# Altium schematic sheet STM32_ESP.SchDoc
size 330 x 203 mm
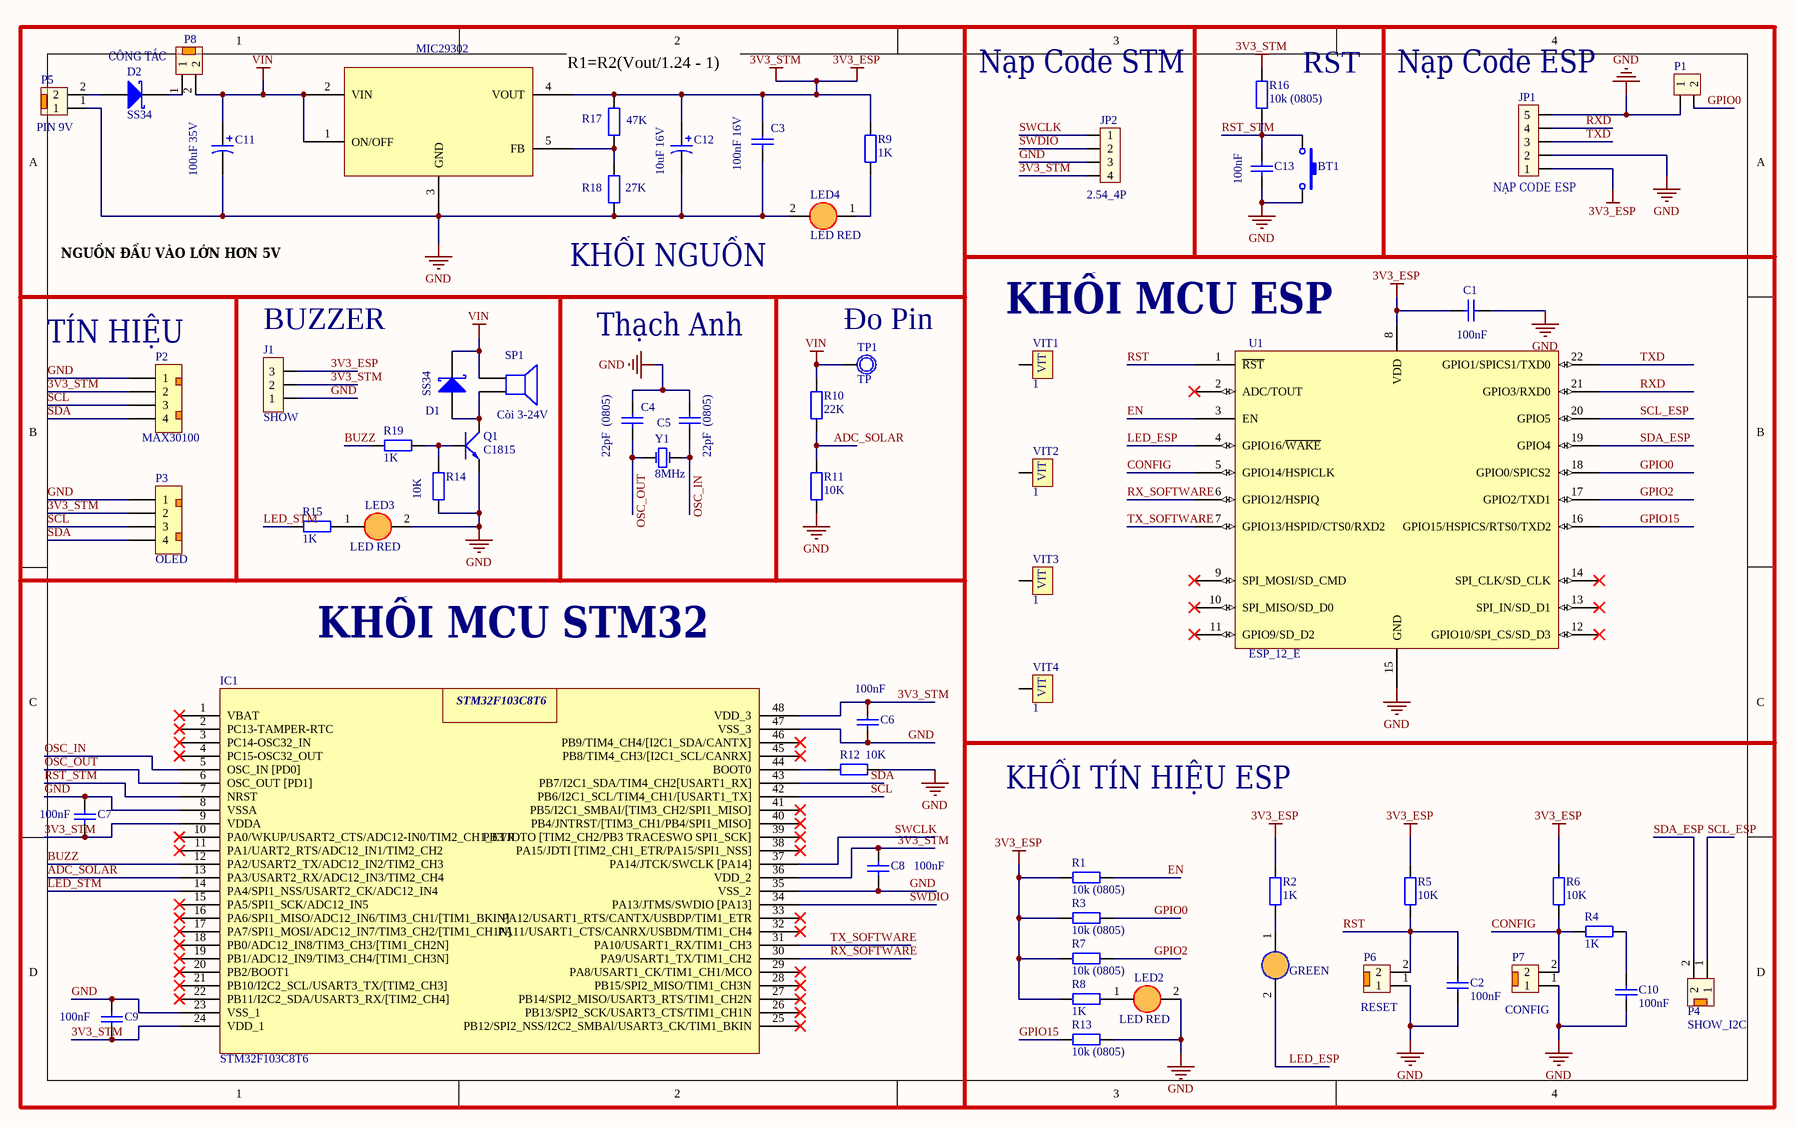
[diagram p0: STM32_ESP.SchDoc]

## Parts
BT1  Nút Nhấn 2 Chân 3x6x2.5MM SMD  [Nut Nhan 2 Chan SMD_N]  (value not drawn)
C1  100nF  [Tu 0805]
C2  100nF  [tu 0805]
C3  100nF 16V  [tu 0805]
C4  22pF  (0805)  [tu 0805]
C5  22pF  (0805)  [tu 0805]
C6  100nF  [tu 0805]
C7  100nF  [tu 0805]
C8  100nF  [tu 0805]
C9  100nF  [tu 0805]
C10  100nF  [tu 0805]
C11  100uF 35V  [CAP_ALUM_SMD_100102_TYPE_G]
C12  10uF 16V  [CAP_ALUM_SMD_5054_TYPE_C]
C13  100nF  [tu 0805]
D1  SS34  [DIODE_DO214AC_SMA]
D2  SS34  [DIODE_DO214AC_SMA]
IC1  STM32F103C8T6  [LQFP48]
J1  SHOW  [jump don duc thang 2.54_3p]
JP1  NẠP CODE ESP  [jump don duc 2.54_5p]
JP2  2.54_4P  [JUMP DON DUC 2.54_4P]
LED1  GREEN  [led 0805]
LED2  LED RED  [led 0805]
LED3  LED RED  [led 0805]
LED4  LED RED  [led 0805]
MIC1  MIC29302  [Mic5V]
P1  2P  [Jump don duc 2.54_2P]  (value not drawn)
P2  MAX30100  [Header Duc Thang 4p 2.54]
P3  OLED  [Header Duc Thang 4p 2.54]
P4  SHOW_I2C  [Header Duc Thang 2P 2.54]
P5  PIN 9V  [Header Duc Thang 2P 2.54]
P6  RESET  [Header Duc Thang 2P 2.54]
P7  CONFIG  [Header Duc Thang 2P 2.54]
P8  CÔNG TẮC  [Header Duc Thang 2P 2.54]
Q1  C1815  [SOT23B]
R1  10k (0805)  [tro 0805]
R2  1K  [tro 0805]
R3  10k (0805)  [tro 0805]
R4  1K  [tro 0805]
R5  10K  [tro 0805]
R6  10K  [tro 0805]
R7  10k (0805)  [tro 0805]
R8  1K  [tro 0805]
R9  1K  [tro 0805]
R10  22K  [tro 0805]
R11  10K  [tro 0805]
R12  10K  [tro 0805]
R13  10k (0805)  [tro 0805]
R14  10K  [tro 0805]
R15  1K  [tro 0805]
R16  10k (0805)  [tro 0805]
R17  47K  [tro 0805]
R18  27K  [tro 0805]
R19  1K  [tro 0805]
SP1  Còi 3-24V  [SPEAKER]
TP1  TP  [TP1]
U1  ESP_12_E  [ESP8266_12_E_L]
VIT1  1  [VIT]
VIT2  1  [VIT]
VIT3  1  [VIT]
VIT4  1  [VIT]
Y1  8MHz  [thach anh 49s smd]

## Nets
3V3_ESP: C1.2 C3.1 C6.1 C7.2 C8.1 C9.2 C12.1 IC1.9(VDDA) IC1.24(VDD_1) IC1.36(VDD_2) IC1.48(VDD_3) J1.2 J1.3 JP1.1 JP2.4 MIC1.4(VOUT) P2.2 P3.2 R1.2 R2.1 R3.2 R5.1 R6.1 R7.2 R8.1 R9.2 R16.2 R17.1 U1.8(VDD)  [also labelled 3V3_STM]
GND: BT1.2 C1.1 C2.2 C3.2 C4.1 C5.1 C6.2 C7.1 C8.2 C9.1 C10.2 C11.2 C12.2 C13.2 IC1.8(VSSA) IC1.23(VSS_1) IC1.35(VSS_2) IC1.47(VSS_3) J1.1 JP1.2 JP1.5 JP2.3 LED2.2(K) LED3.2(K) LED4.2(K) MIC1.3(GND) P1.1 P2.1 P3.1 P5.1 P6.1 P7.1 Q1.1(E) R11.1 R12.2 R13.1 R14.1 R18.2 U1.15(GND)
VIN: C11.1 D1.2(K) MIC1.1(ON/OFF) MIC1.2(VIN) P8.2 R10.2 SP1.1 TP1.1
ADC_SOLAR: IC1.13(PA3/USART2_RX/ADC12_IN3/TIM2_CH4) R10.1 R11.2
BUZZ: IC1.12(PA2/USART2_TX/ADC12_IN2/TIM2_CH3) R19.2
CONFIG: P7.2 R4.1 R6.2 U1.5(GPIO14/HSPICLK)
EN: R1.1 U1.3(EN)
GPIO0: P1.2 R3.1 U1.18(GPIO0/SPICS2)
GPIO2: R7.1 U1.17(GPIO2/TXD1)
GPIO15: R13.2 U1.16(GPIO15/HSPICS/RTS0/TXD2)
LED_ESP: LED1.2(K) U1.4(GPIO16/~{WAKE})
LED_STM: IC1.14(PA4/SPI1_NSS/USART2_CK/ADC12_IN4) R15.1
OSC_IN: C5.2 IC1.5(OSC_IN_[PD0]) Y1.2(OSC2)
OSC_OUT: C4.2 IC1.6(OSC_OUT_[PD1]) Y1.1(OSC1)
RST: C2.1 P6.2 R5.2 U1.1(~{RST})
RST_STM: BT1.1 C13.1 IC1.7(NRST) R16.1
RX_SOFTWARE: IC1.30(PA9/USART1_TX/TIM1_CH2) U1.6(GPIO12/HSPIQ)
RXD: JP1.4 U1.21(GPIO3/RXD0)
SCL: IC1.42(PB6/I2C1_SCL/TIM4_CH1/[USART1_TX]) P2.3 P3.3
SCL_ESP: P4.1 U1.20(GPIO5)
SDA: IC1.43(PB7/I2C1_SDA/TIM4_CH2[USART1_RX]) P2.4 P3.4
SDA_ESP: P4.2 U1.19(GPIO4)
SWCLK: IC1.37(PA14/JTCK/SWCLK_[PA14]) JP2.1
SWDIO: IC1.34(PA13/JTMS/SWDIO_[PA13]) JP2.2
TX_SOFTWARE: IC1.31(PA10/USART1_RX/TIM1_CH3) U1.7(GPIO13/HSPID/CTS0/RXD2)
TXD: JP1.3 U1.22(GPIO1/SPICS1/TXD0)
NetC10_1: C10.1 R4.2
NetD1_1: D1.1(A) Q1.2(C) SP1.2
NetD2_1: D2.1(A) P5.2
NetD2_2: D2.2(K) P8.1
NetIC1_44: IC1.44(BOOT0) R12.1
NetLED1_1: LED1.1(A) R2.2
NetLED2_1: LED2.1(A) R8.2
NetLED3_1: LED3.1(A) R15.2
NetLED4_1: LED4.1(A) R9.1
NetMIC1_5: MIC1.5(FB) R17.2 R18.1
NetQ1_3: Q1.3(B) R14.2 R19.1

Not connected (* = marked no-connect by the designer): IC1 1(VBAT)* 2(PC13-TAMPER-RTC)* 3(PC14-OSC32_IN)* 4(PC15-OSC32_OUT)* 10(PA0/WKUP/USART2_CTS/ADC12-IN0/TIM2_CH1_ETR)* 11(PA1/UART2_RTS/ADC12_IN1/TIM2_CH2)* 15(PA5/SPI1_SCK/ADC12_IN5)* 16(PA6/SPI1_MISO/ADC12_IN6/TIM3_CH1/[TIM1_BKIN])* 17(PA7/SPI1_MOSI/ADC12_IN7/TIM3_CH2/[TIM1_CH1N])* 18(PB0/ADC12_IN8/TIM3_CH3/[TIM1_CH2N])* 19(PB1/ADC12_IN9/TIM3_CH4/[TIM1_CH3N])* 20(PB2/BOOT1)* 21(PB10/I2C2_SCL/USART3_TX/[TIM2_CH3])* 22(PB11/I2C2_SDA/USART3_RX/[TIM2_CH4])* 25(PB12/SPI2_NSS/I2C2_SMBAl/USART3_CK/TIM1_BKIN)* 26(PB13/SPI2_SCK/USART3_CTS/TIM1_CH1N)* 27(PB14/SPI2_MISO/USART3_RTS/TIM1_CH2N)* 28(PB15/SPI2_MISO/TIM1_CH3N)* 29(PA8/USART1_CK/TIM1_CH1/MCO)* 32(PA11/USART1_CTS/CANRX/USBDM/TIM1_CH4)* 33(PA12/USART1_RTS/CANTX/USBDP/TIM1_ETR)* 38(PA15/JDTI_[TIM2_CH1_ETR/PA15/SPI1_NSS])* 39(PB3/JDTO_[TIM2_CH2/PB3_TRACESWO_SPI1_SCK])* 40(PB4/JNTRST/[TIM3_CH1/PB4/SPI1_MISO])* 41(PB5/I2C1_SMBAI/[TIM3_CH2/SPI1_MISO])* 45(PB8/TIM4_CH3/[I2C1_SCL/CANRX])* 46(PB9/TIM4_CH4/[I2C1_SDA/CANTX])*; U1 2(ADC/TOUT)* 9(SPI_MOSI/SD_CMD)* 10(SPI_MISO/SD_D0)* 11(GPIO9/SD_D2)* 12(GPIO10/SPI_CS/SD_D3)* 13(SPI_IN/SD_D1)* 14(SPI_CLK/SD_CLK)*; VIT1 VIT1(1); VIT2 VIT1(1); VIT3 VIT1(1); VIT4 VIT1(1)

## Notes on the sheet
- R1=R2(Vout/1.24 - 1)
- Nạp Code STM
- (near R16) RST
- (near JP1) Nạp Code ESP
- NGUỒN ĐẦU VÀO LỚN HƠN 5V
- (near R18) KHỐI NGUỒN
- KHỐI MCU ESP
- (near P2) TÍN HIỆU
- (near J1) BUZZER
- Thạch Anh
- (near TP1) Đo Pin
- KHỐI MCU STM32
- KHỐI TÍN HIỆU ESP
- Title
- Size:
- Date:
- A4
- Number:
- Time:
- Revision:
- Sheet
- of
- File:

## Library data of the parts
BT1 = Nut Nhan 2 Chan SMD: Dán; Don_Vi: Con; So_Chan: 2; Ma_Hang: MH001036; Kieu_Chan: *; Ten_Linh_Kien: Nút Nhấn 2 Chân 3x6x2.5MM SMD; Chung_Loai: Dán
C1 = Tu 0805 106 16V 10%: Dán; Ten_Linh_Kien: Tụ 0805 106-10uF 10% 16V; So_Chan: 2; Don_Vi: Con; Ma_Hang: MH004553; Chung_Loai: Dán; Kieu_Chan: *
C2 C10 = Tu 0805 6.8nF 50V 10%: Dán; Don_Vi: Con; Ten_Linh_Kien: Tụ 0805 6.8nF 10% 50V; Ma_Hang: MH009987; Chung_Loai: Dán
C3-C5 = Tu 0805 22pF 50V 10%: Dán; Don_Vi: Con; So_Chan: 2; Ten_Linh_Kien: Tụ 0805 22P 10% 50V; Ma_Hang: MH004560; Chung_Loai: Dán; Kieu_Chan: *
C6-C9 C13 = Tu 0805 104 50V 10%: Dán; Don_Vi: Con; So_Chan: 2; Ten_Linh_Kien: Tụ 0805 104-100nF 10% 50V; Ma_Hang: MH004551; Chung_Loai: Dán; Kieu_Chan: *
C11 = EEE-FK1C331P: CAP ALUM 330uF 20% 35V SMD; MFR: Panasonic; Value: 330uF/35V; Solder: SMT; MPN: EEE-FK1C331P; Category: CAPACITOR; PinCount: 2
C12 = EEE-FK1C330P: CAP ALUM 33uF 20% 16V SMD; MFR: Panasonic; Value: 33uF/16V; Solder: SMT; MPN: EEE-FK1C330P; Category: CAPACITOR; PinCount: 2
D1 D2 = SS34: DIODE SCHOTTKY 40V 3A SMA; Solder: SMT; MPN: SS34; Value: SS34; MFR: *
IC1 = STM32F103C8T6: Dán; Ten_Linh_Kien: STM32F103C8T6 LQFP48; Ma_Hang: MH000567; Don_Vi: Con; So_Chan: 48; Kieu_Chan: LQFP48; Chung_Loai: Dán
J1 = Jump Don Duc Thang 2.54_3P: Cắm; Ten_Linh_Kien: Jump Đơn Đực 2.54MM 1x40P Thẳng 11MM; Ma_Hang: MH000903; Don_Vi: Con; So_Chan: 2; Kieu_Chan: *; Chung_Loai: Cắm
JP1 = Jump Don Duc 2.54_5P: Cắm; Ten_Linh_Kien: Jump Đơn Đực 2.54MM 2x40P Thẳng 11MM; Don_Vi: Con; So_Chan: 5; Ma_Hang: MH000903; Kieu_Chan: *; Chung_Loai: Cắm
JP2 = Jump Don Duc 2.54_4P: Cắm; Ten_Linh_Kien: Jump Đơn Đực 2.54MM 2x40P Thẳng 11MM; Don_Vi: Con; So_Chan: 4; Kieu_Chan: *; Ma_Hang: *; Chung_Loai: Cắm
LED1 = Led 0805 Xanh Duong: Dán; Don_Vi: Con; So_Chan: 2; Ten_Linh_Kien: LED 0805 Màu Xanh Dương (Blue); Ma_Hang: MH002327; Chung_Loai: Dán; Kieu_Chan: *
LED2-LED4 = Led 0805 Do: Dán; Don_Vi: Con; So_Chan: 2; Ten_Linh_Kien: LED 0805 Màu Đỏ; Ma_Hang: MH000897; Chung_Loai: Dán; Kieu_Chan: *
MIC1 = Mic5V: 3A
P1 = Jum don duc 2.54_2P: Cắm; Don_Vi: Con; Kieu_Chan: Jump don duc 2.54; So_Chan: 2; Ma_Hang: MH000903; Ten_Linh_Kien: Jum đơn đực 2.54MM 1X40P Thẳng 11MM; Chung_Loai: Cắm
P2 P3 = Header 2.54_4p Duc Thang: Cắm; Don_Vi: Con; So_Chan: 4; Ten_Linh_Kien: Header 4P XH2.54-4P Đực Thẳng; Ma_Hang: MH001285; Chung_Loai: Cắm; Kieu_Chan: *
P4-P8 = Header 2.54-2p Duc Thang: Cắm; So_Chan: 2; Don_Vi: Con; Ten_Linh_Kien: Header 2P XH2.54-2P Đực Thẳng; Ma_Hang: MH001283; Chung_Loai: Cắm; Kieu_Chan: *
Q1 = C1815: Dán; Ten_Linh_Kien: C1815 SOT23 TRANS NPN 0.15A 50V (SMD-HF); Don_Vi: Con; Ma_Hang: MH000946; Ghi_Chu: *; Kieu_Chan: *; Chung_Loai: Dán
R1 R3 R5-R7 R9-R11 R13 R16-R18 = Tro 0805 5% 10k: Dán; Don_Vi: Con; So_Chan: 2; Ten_Linh_Kien: Trở 0805 5% 10k; Ma_Hang: MH005239; Chung_Loai: Dán; Kieu_Chan: *
R2 R4 R8 R15 = Tro 0805 5% 1.5k: Dán; Don_Vi: Con; So_Chan: 2; Ten_Linh_Kien: Trở 0805 5% 1.5k; Ma_Hang: MH005232; Chung_Loai: Dán; Kieu_Chan: *
R12 = Tro 0805 1% 10k: Dán; Don_Vi: Con; So_Chan: 2; Ten_Linh_Kien: Trở 0805 1% 10k; Ma_Hang: MH005473; Chung_Loai: Dán; Kieu_Chan: *
R14 R19 = Tro 0805 5% 470R: Dán; Don_Vi: Con; Ma_Hang: MH005341; Ten_Linh_Kien: Trở 0805 5% 470R; So_Chan: 2; Chung_Loai: Dán; Kieu_Chan: *
SP1 = Coi Chip 5V: Cắm; Ten_Linh_Kien: Còi Chip 5V 9.5x12MM; Don_Vi: Con; Ma_Hang: MH000902; Ghi_Chu: *; Kieu_Chan: *; Chung_Loai: Cắm
TP1 = TP1: Test Point; Value: Test Point
U1 = ESP_12_E: ESP-12 Wi-Fi Module by AI-Thinker; IC: ESP8266EX; Vendor: AI-Thinker; Value: ESP_12_E
VIT1-VIT4 = VIT: Oc Vit
Y1 = Thach anh 8MHz 49S SMD: Dán; Kieu_Chan: 49S SMD; Don_Vi: Con; So_Chan: 2; Ten_Linh_Kien: Thạch anh 8MHz 49S SMD; Ma_Hang: MH001985; Chung_Loai: Dán